# EAGLE design TCRT5000 - MODULO (EAGLE 8.7.0)
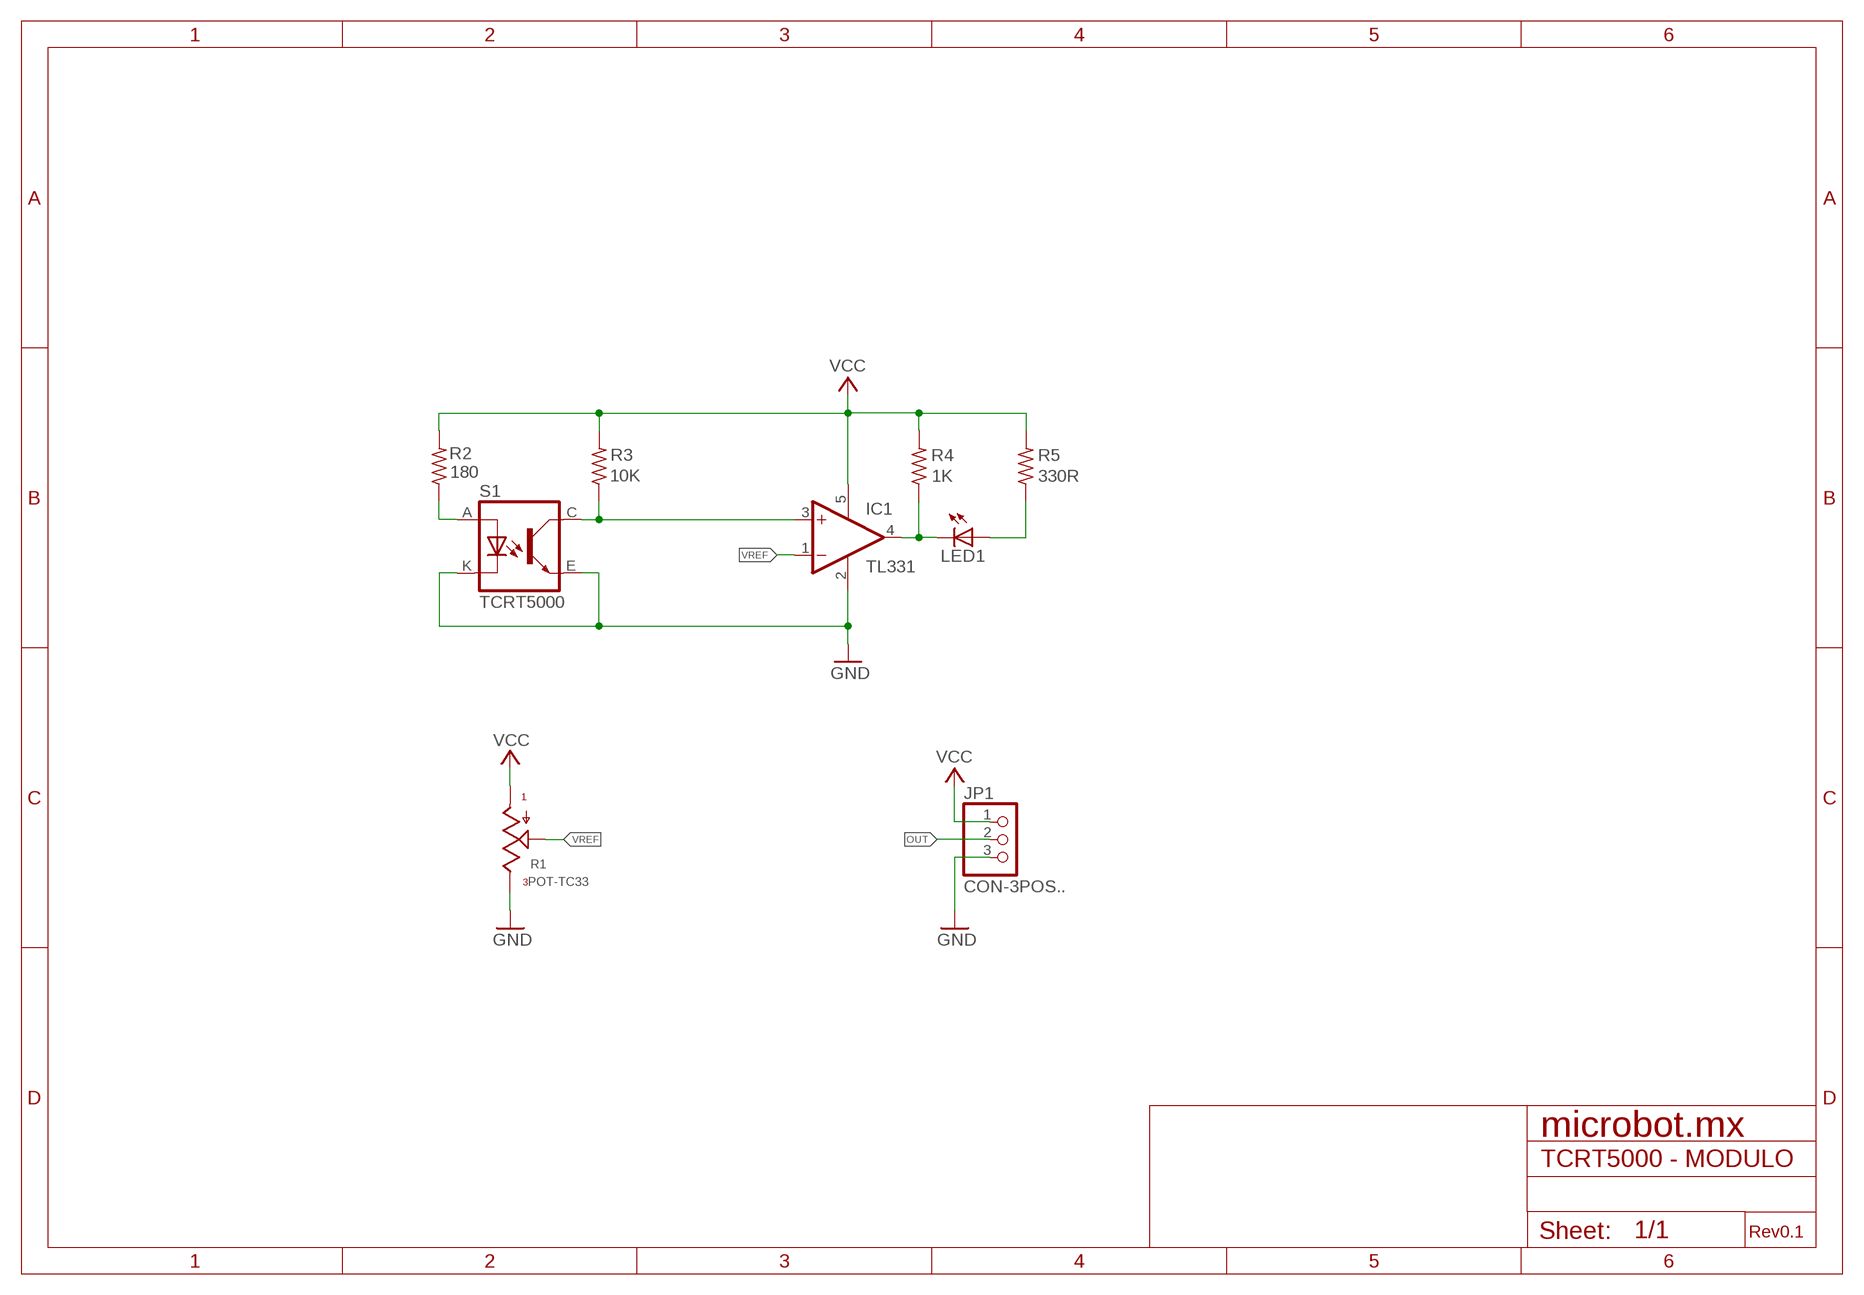
[diagram p0: schematic, sheet 1]

## Parts
IC1  TL331  [DBV-R-PDSO-G5]
JP1  CON-3POS..  [1X03-GND]
LED1  LEDCHIPLED_1206  [CHIPLED_1206]
R1  POT-TC33  [TC33]
R2  180  R-US_R1206  [R1206]
R3  10K  R-US_R1206  [R1206]
R4  1K  R-US_R1206  [R1206]
R5  330R  R-US_R1206  [R1206]
S1  TCRT5000  [TCRT5000]

## Nets
GND: IC1.2(GND) JP1.3 R1.3 S1.E(EMISOR) S1.K(CÁTODO)
N$1: R2.1 S1.A(ÁNODO)
N$2: IC1.3(+IN) R3.1 S1.C(COLECTOR)
N$3: LED1.A R5.1
OUT: IC1.4(OUT) JP1.2 LED1.C R4.1
VCC: IC1.5(V+) JP1.1 R1.1 R2.2 R3.2 R4.2 R5.2
VREF: IC1.1(-IN) R1.2

## Notes on the sheet
- microbot.mx
- Rev0.1

## Library data of the parts
IC1 = linear:TL331: SINGLE DIFFERENTIAL COMPARATOR Source: Data sheet <http://www.ti.com/lit/ds/symlink/tl331-q1.pdf>
JP1 = Microbot-Conectores:CON-3POS: Conector 3 pines
LED1 = led:LED: LED OSRAM: - CHIPLED LG R971, LG N971, LY N971, LG Q971, LY Q971, LO R971, LY R971 LH N974, LH R974 LS Q976, LO Q976, LY Q976 LO Q996 - Hyper CHIPLED LW Q18S LB Q993, LB Q99A, LB R99A - SideLED LS A670, LO A670, LY A670, LG A670, LP A670 LB A673, LV A673, LT A673, LW A673 LH A674 LY A675 LS A676, LA A676, LO A676, LY A676, LW A676 LS A679, LY A679, LG A679 - Hyper Micro SIDELED® LS Y876, LA Y876, LO Y876, LY Y876 LT Y87S - SmartLED LW L88C, LW L88S LB L89C, LB L89S, LG L890 LS L89K, LO L89K, LY L89K LS L896, LA L896, LO L896, LY L896 - TOPLED LS T670, LO T670, LY T670, LG T670, LP T670 LSG T670, LSP T670, LSY T670, LOP T670, LYG T670 LG T671, LOG T671, LSG T671 LB T673, LV T673, LT T673, LW T673 LH T674 LS T676, LA T676, LO T676, LY T676, LB T676, LH T676, LSB T676, LW T676 LB T67C, LV T67C, LT T67C, LS T67K, LO T67K, LY T67K, LW E67C LS E67B, LA E67B, LO E67B, LY E67B, LB E67C, LV E67C, LT E67C LW T67C LS T679, LY T679, LG T679 LS T770, LO T770, LY T770, LG T770, LP T770 LB T773, LV T773, LT T773, LW T773 LH T774 LS E675, LA E675, LY E675, LS T675 LS T776, LA T776, LO T776, LY T776, LB T776 LHGB T686 LT T68C, LB T68C - Hyper Mini TOPLED® LB M676 - Mini TOPLED Santana® LG M470 LS M47K, LO M47K, LY M47K Source: http://www.osram.convergy.de LUXEON: - LUMILED® LXK2-PW12-R00, LXK2-PW12-S00, LXK2-PW14-U00, LXK2-PW14-V00 LXK2-PM12-R00, LXK2-PM12-S00, LXK2-PM14-U00 LXK2-PE12-Q00, LXK2-PE12-R00, LXK2-PE12-S00, LXK2-PE14-T00, LXK2-PE14-U00 LXK2-PB12-K00, LXK2-PB12-L00, LXK2-PB12-M00, LXK2-PB14-N00, LXK2-PB14-P00, LXK2-PB14-Q00 LXK2-PR12-L00, LXK2-PR12-M00, LXK2-PR14-Q00, LXK2-PR14-R00 LXK2-PD12-Q00, LXK2-PD12-R00, LXK2-PD12-S00 LXK2-PH12-R00, LXK2-PH12-S00 LXK2-PL12-P00, LXK2-PL12-Q00, LXK2-PL12-R00 Source: www.luxeon.com KINGBRIGHT: KA-3528ASYC Source: www.kingbright.com
R1 = Microbot-Potenciometros:POT-TC33: Potenciometro TC33 Hoja de datos: www.bourns.com/docs/Product-Datasheets/TC33.PDF
R2-R5 = rcl:R-US_: RESISTOR, American symbol; SPICEPREFIX: R
S1 = Sensores:TCRT5000: Sensor óptico reflectivo www.vishay.com/docs/83760/tcrt5000.pdf

## Board
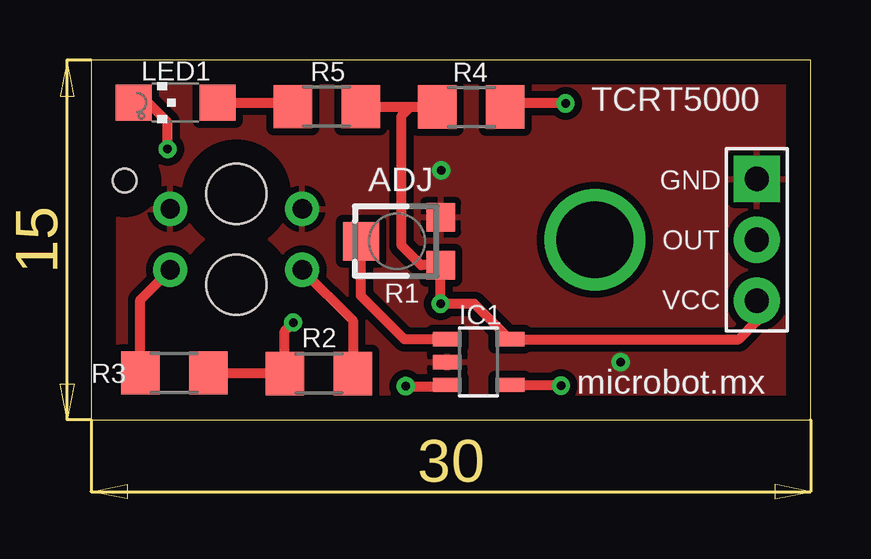
[diagram p1: board, top side]
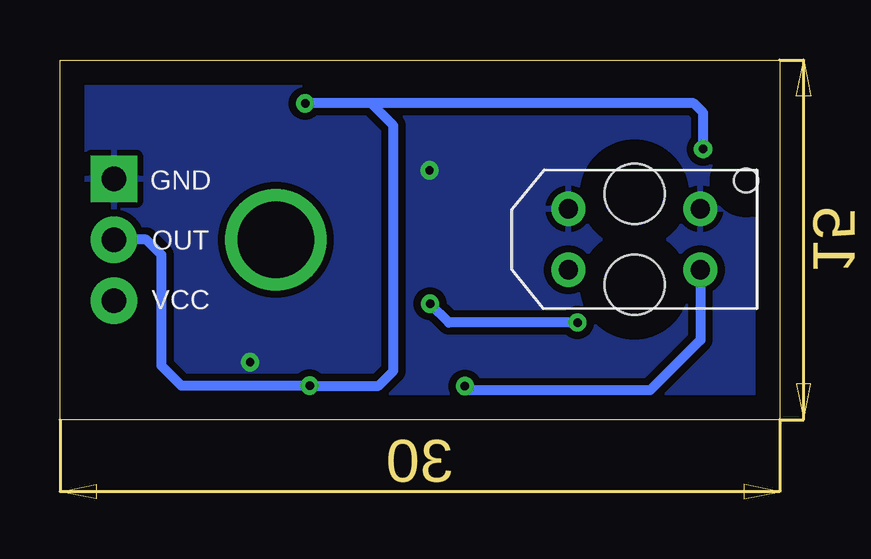
[diagram p2: board, bottom side, seen from below]

Size 30 x 15 mm. Coordinates in mm from the lower left corner, seen from the top.
Outline: 0,0 30,0 30,15 0,15 0,0
Copper layers (1*16): Top 0.035mm / dielectric 1.5mm / Bottom 0.035mm
Design rules "default": minimum track width 6mil, minimum drill 0.35mm, track to track 6mil, track to pad 6mil, pad to pad 6mil, via to via 6mil, smd to smd 6mil, copper to edge 40mil, drill to drill 6mil, minimum pad ring 10mil, minimum via ring 8mil, stop-mask expansion 4mil, vias tented up to drill 0mil, thermal gap 10mil

### Footprints (pad centres in the part's own frame; a part is rotated, then mirrored left to right if it is on the bottom)
DBV-R-PDSO-G5 = smd 0.6 x 1.2: 1 -0.95,-1.306; 2 0,-1.306; 3 0.95,-1.306; 4 0.95,1.306; 5 -0.95,1.306
1X03-GND = drill 1.016 pad 1.93: 1 -2.54,0; 2 0,0 | drill 1.016 pad 1.93 square: 3 2.54,0
CHIPLED_1206 = smd 1.5 x 1.5: A 0,-1.75; C 0,1.75
TC33 = smd 1.2 x 1.2: 1 -1,-1.825; 3 1,-1.825 | smd 1.6 x 1.5: 2 0,1.5
R1206 = smd 1.6 x 1.803: 1 -1.422,0; 2 1.422,0
TCRT5000 = drill 0.8 pad 1.422: A 2.75,1.27; C -2.75,1.27; E -2.75,-1.27; K 2.75,-1.27 | hole 2.5: 0,1.9; 0,-1.9 | hole 1: -4.65,-2.45

### Placement (x,y rotation side)
IC1  16.15,2.4 270 top
JP1  27.75,7.5 90 top
LED1  3.52,13.22 90 top
R1  12.75,7.44 90 top
R2  9.49,1.92 180 top
R3  3.47,1.94 0 top
R4  15.85,13.04 180 top
R5  9.83,13.05 0 top
S1  6.05,7.52 180 bottom

### Tracks (layer width: path | path; a pad name or v marks a point on that pad's centre or on a via)
GND  (via drill 0.35)
  other vias: 14.59,10.39 22.07,2.4
  pour Top (isolate 0.305): 0,15 30,15 30,0 0,0
  pour Bottom (isolate 0.305): 0,15 30,15 30,0 0,0
N$1
  Top 0.406: S1.A 10.91,4.13 R2.1
N$2  (via drill 0.35)
  Top 0.406: R3.1 2.05,5 S1.C | v13.12,1.39 14.79,1.39 IC1.3
  Bottom 0.406: S1.C 3.3,3.32 5.4,1.22 12.94,1.22 v13.12,1.39
N$3
  Top 0.406: LED1.A 8.23,13.22 R5.1
N$4  (via drill 3.2)
  other vias: 21,7.5
OUT  (via drill 0.35)
  Top 0.406: 1.77,12.71 LED1.C 2.37,13.22 3.19,12.4 v3.19,11.29 | v19.78,13.19 17.42,13.19 R4.1 | IC1.4 19.55,1.45 v19.59,1.42
  Bottom 0.406: v3.19,11.29 3.19,12.79 3.58,13.19 17.04,13.19 | 17.04,13.19 v19.78,13.19 | 17.04,13.19 16.1,12.25 16.1,2.04 16.73,1.42 v19.59,1.42 24.93,1.42 25.77,2.25 25.77,6.87 26.4,7.5 JP1.2
VCC  (via drill 0.35)
  Top 0.406: 4.91,1.92 R3.2 8.05,1.94 R2.2 8.07,3.7 v8.42,4.05 | R5.2 13.32,13.05 | 13.32,13.05 14.42,13.05 R4.2 | 13.32,13.05 12.94,12.67 12.94,7.25 13.75,6.44 R1.1 v14.57,4.83 15.97,4.83 IC1.5 26.99,3.35 27.76,4.11 JP1.1
  Bottom 0.406: v8.42,4.05 13.79,4.05 v14.57,4.83
VREF
  Top 0.406: IC1.1 13.06,3.35 11.25,5.16 R1.2

### Text on the board
tPlace: TCRT5000 | ADJ | GND | OUT | VCC | microbot.mx
bPlace: GND | OUT | VCC